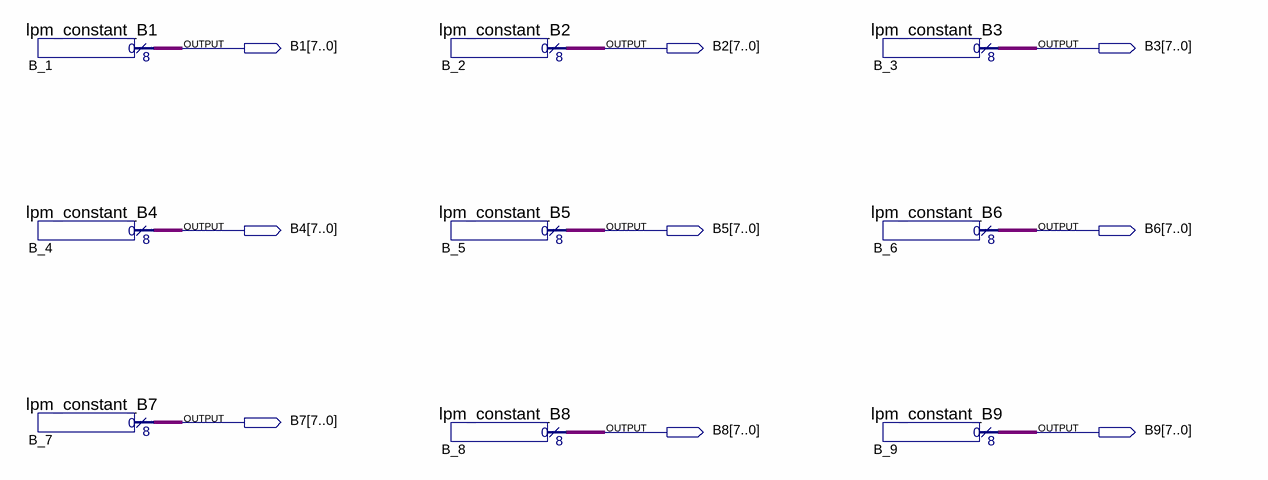
[diagram p0: schematic sheet]
// Quartus schematic B_Template.bdf as structural Verilog: 9 symbols, 9 pins
module B_Template (
  output [7:0] B1,
  output [7:0] B2,
  output [7:0] B3,
  output [7:0] B4,
  output [7:0] B5,
  output [7:0] B6,
  output [7:0] B7,
  output [7:0] B8,
  output [7:0] B9
);

  lpm_constant_B1 B_1 (.result(B1));
  lpm_constant_B4 B_4 (.result(B4));
  lpm_constant_B7 B_7 (.result(B7));
  lpm_constant_B2 B_2 (.result(B2));
  lpm_constant_B5 B_5 (.result(B5));
  lpm_constant_B8 B_8 (.result(B8));
  lpm_constant_B3 B_3 (.result(B3));
  lpm_constant_B6 B_6 (.result(B6));
  lpm_constant_B9 B_9 (.result(B9));
endmodule
